# Altium schematic sheet CanGateLPC1768_rev1.SchDoc
size A3
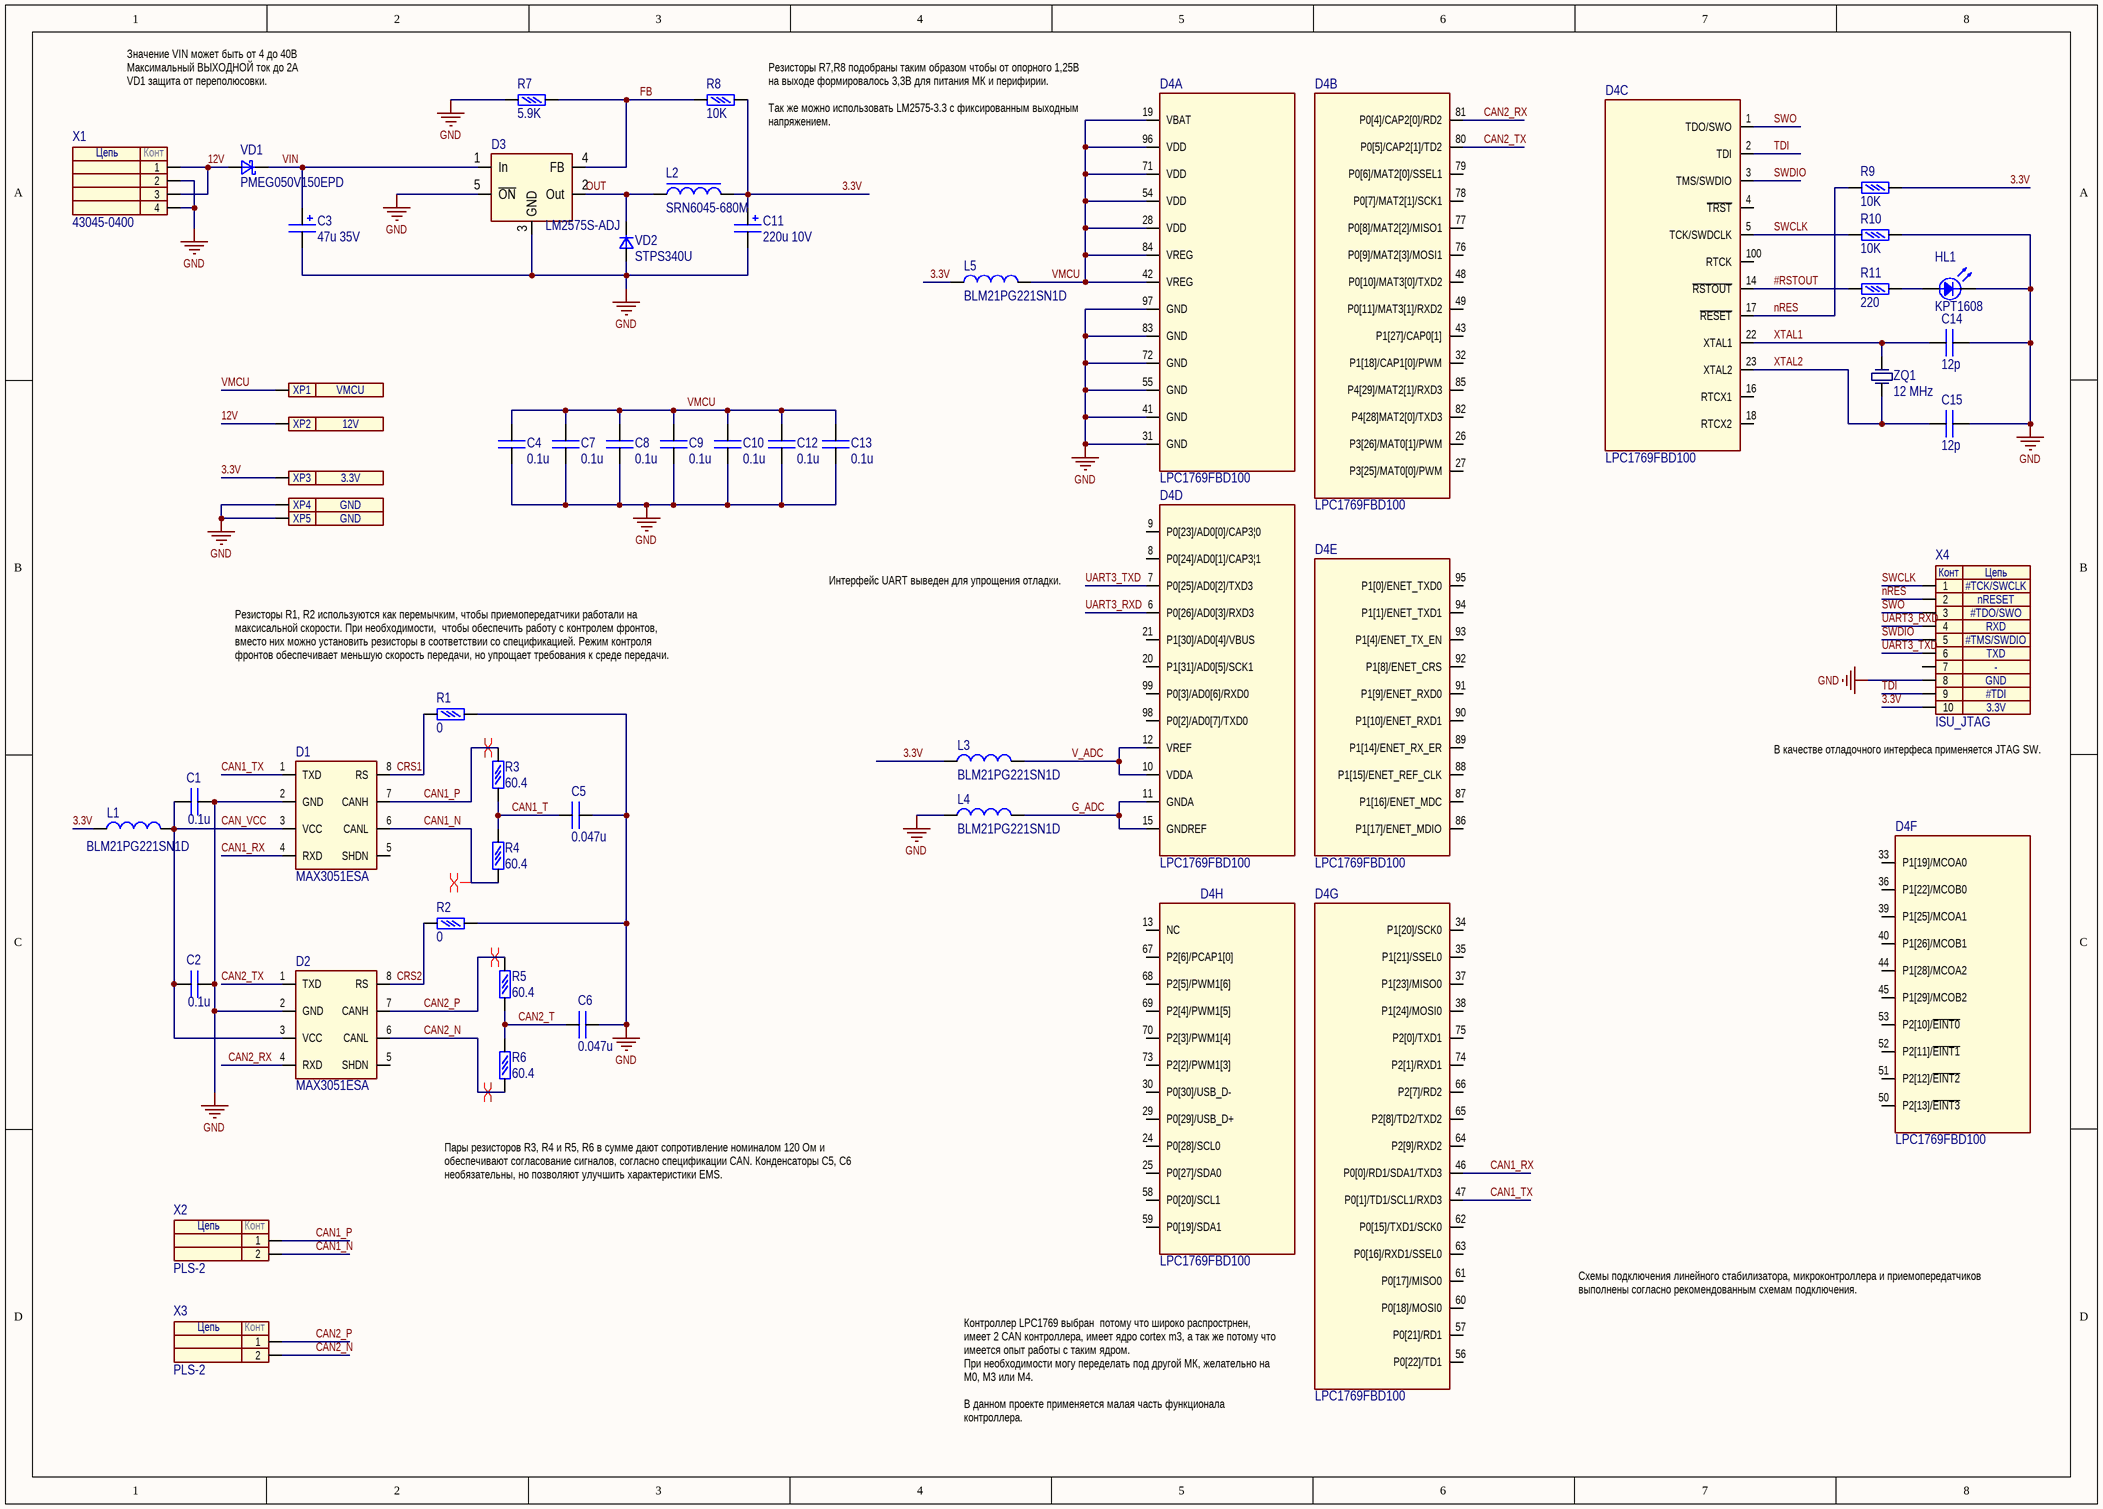
[diagram p0: CanGateLPC1768_rev1.SchDoc]

## Parts
C1  0.1u  [C 0603]
C2  0.1u  [C 0603]
C3  47u 35V  [C E-CASE]
C4  0.1u  [C 0603]
C5  0.047u  [C 0603]
C6  0.047u  [C 0603]
C7  0.1u  [C 0603]
C8  0.1u  [C 0603]
C9  0.1u  [C 0603]
C10  0.1u  [C 0603]
C11  220u 10V  [C D-CASE]
C12  0.1u  [C 0603]
C13  0.1u  [C 0603]
C14  12p  [C 0603]
C15  12p  [C 0603]
D1  MAX3051ESA  [SO-8]
D2  MAX3051ESA  [SO-8]
D3  LM2575S-ADJ  [DPAK-5]
D4  LPC1769FBD100  [LQFP100]  (parts A,B,C,D,E,F,G,H of 8)
HL1  KPT1608  [HL 1608]
L1  BLM21PG221SN1D  [L 0805]
L2  SRN6045-680M  [L SRN6045]
L3  BLM21PG221SN1D  [L 0805]
L4  BLM21PG221SN1D  [L 0805]
L5  BLM21PG221SN1D  [L 0805]
R1  0  [R 0603]
R2  0  [R 0603]
R3  60.4  [R 0603]
R4  60.4  [R 0603]
R5  60.4  [R 0603]
R6  60.4  [R 0603]
R7  5.9K  [R 0603]
R8  10K  [R 0603]
R9  10K  [R 0603]
R10  10K  [R 0603]
R11  220  [R 0603]
VD1  PMEG050V150EPD  [VD SOT1289]
VD2  STPS340U  [VD SMB]
X1  43045-0400  [MICRO-FIT-4]
X2  PLS-2  [JST XH B2B-XH-A]
X3  PLS-2  [JST XH B2B-XH-A]
X4  ISU_JTAG  [PLD2-10]
XP1  VMCU  [Test Pin]  (no BOM)
XP2  12V  [Test Pin]  (no BOM)
XP3  3.3V  [Test Pin]  (no BOM)
XP4  GND  [Test Pin]  (no BOM)
XP5  GND  [Test Pin]  (no BOM)
ZQ1  12 MHz  [ZQ HC-49SMD]

## Nets
GND: C1.2 C2.2 C3.2 C4.2 C5.2 C6.2 C7.2 C8.2 C9.2 C10.2 C11.2 C12.2 C13.2 C14.1 C15.2 D1.2(GND) D2.2(GND) D3.3(GND) D3.5(~{ON}) D4.31(GND) D4.41(GND) D4.55(GND) D4.72(GND) D4.83(GND) D4.97(GND) HL1.2 L4.1 R1.1 R2.1 R7.1 R10.1 VD2.1 X1.2 X1.4 X4.8 XP4.1 XP5.1
3.3V: C11.1 L1.1 L2.2 L3.1 L5.1 R8.2 R9.1 X4.10 XP3.1
12V: VD1.1 X1.1 X1.3 XP2.1
#RSTOUT: D4.14(~{RSTOUT}) R11.2
CAN1_N: D1.6(CANL) R4.2 X2.2
CAN1_P: D1.7(CANH) R3.1 X2.1
CAN1_RX: D1.4(RXD) D4.46(P0[0]/RD1/SDA1/TXD3)
CAN1_T: C5.1 R3.2 R4.1
CAN1_TX: D1.1(TXD) D4.47(P0[1]/TD1/SCL1/RXD3)
CAN2_N: D2.6(CANL) R6.2 X3.2
CAN2_P: D2.7(CANH) R5.1 X3.1
CAN2_RX: D2.4(RXD) D4.81(P0[4]/CAP2[0]/RD2)
CAN2_T: C6.1 R5.2 R6.1
CAN2_TX: D2.1(TXD) D4.80(P0[5]/CAP2[1]/TD2)
CAN_VCC: C1.1 C2.1 D1.3(VCC) D2.3(VCC) L1.2
CRS1: D1.8(RS) R1.2
CRS2: D2.8(RS) R2.2
FB: D3.4(FB) R7.2 R8.1
G_ADC: D4.11(GNDA) D4.15(GNDREF) L4.2
nRES: D4.17(~{RESET}) R9.2 X4.2
OUT: D3.2(Out) L2.1 VD2.2
SWCLK: D4.5(TCK/SWDCLK) R10.2 X4.1
SWDIO: D4.3(TMS/SWDIO) X4.5
SWO: D4.1(TDO/SWO) X4.3
TDI: D4.2(TDI) X4.9
UART3_RXD: D4.6(P0[26]/AD0[3]/RXD3) X4.4
UART3_TXD: D4.7(P0[25]/AD0[2]/TXD3) X4.6
V_ADC: D4.10(VDDA) D4.12(VREF) L3.2
VIN: C3.1 D3.1(In) VD1.2
VMCU: C4.1 C7.1 C8.1 C9.1 C10.1 C12.1 C13.1 D4.19(VBAT) D4.28(VDD) D4.42(VREG) D4.54(VDD) D4.71(VDD) D4.84(VREG) D4.96(VDD) L5.2 XP1.1
XTAL1: C14.2 D4.22(XTAL1) ZQ1.2
XTAL2: C15.1 D4.23(XTAL2) ZQ1.1
NetHL1_1: HL1.1 R11.1

Not connected (* = marked no-connect by the designer): D1 5(SHDN); D2 5(SHDN); D4 4(~{TRST}) 8(P0[24]/AD0[1]/CAP3|1) 9(P0[23]/AD0[0]/CAP3|0) 13(NC) 16(RTCX1) 18(RTCX2) 20(P1[31]/AD0[5]/SCK1) 21(P1[30]/AD0[4]/VBUS) 24(P0[28]/SCL0) 25(P0[27]/SDA0) 26(P3[26]/MAT0[1]/PWM) 27(P3[25]/MAT0[0]/PWM) 29(P0[29]/USB_D+) 30(P0[30]/USB_D-) 32(P1[18]/CAP1[0]/PWM) 33(P1[19]/MCOA0) 34(P1[20]/SCK0) 35(P1[21]/SSEL0) 36(P1[22]/MCOB0) 37(P1[23]/MISO0) 38(P1[24]/MOSI0) 39(P1[25]/MCOA1) 40(P1[26]/MCOB1) 43(P1[27]/CAP0[1]) 44(P1[28]/MCOA2) 45(P1[29]/MCOB2) 48(P0[10]/MAT3[0]/TXD2) 49(P0[11]/MAT3[1]/RXD2) 50(P2[13]/~{EINT3}) 51(P2[12]/~{EINT2}) 52(P2[11]/~{EINT1}) 53(P2[10]/~{EINT0}) 56(P0[22]/TD1) 57(P0[21]/RD1) 58(P0[20]/SCL1) 59(P0[19]/SDA1) 60(P0[18]/MOSI0) 61(P0[17]/MISO0) 62(P0[15]/TXD1/SCK0) 63(P0[16]/RXD1/SSEL0) 64(P2[9]/RXD2) 65(P2[8]/TD2/TXD2) 66(P2[7]/RD2) 67(P2[6]/PCAP1[0]) 68(P2[5]/PWM1[6]) 69(P2[4]/PWM1[5]) 70(P2[3]/PWM1[4]) 73(P2[2]/PWM1[3]) 74(P2[1]/RXD1) 75(P2[0]/TXD1) 76(P0[9]/MAT2[3]/MOSI1) 77(P0[8]/MAT2[2]/MISO1) 78(P0[7]/MAT2[1]/SCK1) 79(P0[6]/MAT2[0]/SSEL1) 82(P4[28]MAT2[0]/TXD3) 85(P4[29]/MAT2[1]/RXD3) 86(P1[17]/ENET_MDIO) 87(P1[16]/ENET_MDC) 88(P1[15]/ENET_REF_CLK) 89(P1[14]/ENET_RX_ER) 90(P1[10]/ENET_RXD1) 91(P1[9]/ENET_RXD0) 92(P1[8]/ENET_CRS) 93(P1[4]/ENET_TX_EN) 94(P1[1]/ENET_TXD1) 95(P1[0]/ENET_TXD0) 98(P0[2]/AD0[7]/TXD0) 99(P0[3]/AD0[6]/RXD0) 100(RTCK); X4 7

## Layout directives
differential pair: CAN1_N, CAN1_P, CAN2_N, CAN2_P

## Notes on the sheet
- (near R7) Значение VIN может быть от 4 до 40В
  Максимальный ВЫХОДНОЙ ток до 2А
  VD1 защита от переполюсовки.
- (near R8) Резисторы R7,R8 подобраны таким образом чтобы от опорного 1,25В на выходе формировалось 3,3В для питания МК и перифирии.
  Так же можно использовать LM2575-3.3 c фиксированным выходным напряжением.
- Интерфейс UART выведен для упрощения отладки.
- (near R1) Резисторы R1, R2 используются как перемычким, чтобы приемопередатчики работали на максисальной скорости. При необходимости,  чтобы обеспечить работу с контролем фронтов, вместо них можно установить резисторы в соответствии со спецификацией. Режим контроля фронтов обеспечивает меньшую скорость передачи, но упрощает требования к среде передачи.
- В качестве отладочного интерфеса применяется JTAG SW.
- Пары резисторов R3, R4 и R5, R6 в сумме дают сопротивление номиналом 120 Ом и обеспечивают согласование сигналов, согласно спецификации CAN. Конденсаторы C5, C6 необязательны, но позволяют улучшить характеристики EMS.
- Схемы подключения линейного стабилизатора, микроконтроллера и приемопередатчиков выполнены согласно рекомендованным схемам подключения.
- Контроллер LPC1769 выбран  потому что широко распрострнен,  имеет 2 CAN контроллера, имеет ядро cortex m3, а так же потому что имеется опыт работы с таким ядром.
  При необходимости могу переделать под другой МК, желательно на М0, М3 или М4.
  В данном проекте применяется малая часть функционала контроллера.
- (in symbol ISU_JTAG) Конт; Цепь; #TCK/SWCLK; nRESET; #TDO/SWO; RXD; #TMS/SWDIO; TXD; -; GND; #TDI; 3.3V
- (in symbol MICRO-FIT-4) Цепь; Конт
- (in symbol PLS-2) Цепь; Конт

## Library data of the parts
C1 C2 C4 C7-C10 C12 C13 = C 0603: Чип конденсатор керамический; R1: 0603; R2: 50V; Remark: C.801; ComponentLink1Description: Datasheet; ComponentLink1URL: http://www.smd.ru/katalog/kondensatory/keramicheskie/
C3 = C E-CASE: Чип конденсатор танталовый; R1: 'E'; ComponentLink1Description: Datasheet; ComponentLink1URL: http://www.smd.ru/katalog/kondensatory/polyarnye/tantalovye/
C5 C6 = C 0603: Чип конденсатор керамический; R1: 0603; R2: 50V; Remark: C.806; ComponentLink1Description: Datasheet; ComponentLink1URL: http://www.smd.ru/katalog/kondensatory/keramicheskie/
C11 = C D-CASE: Чип конденсатор танталовый; R1: 'D'; ComponentLink1Description: Datasheet; ComponentLink1URL: http://www.smd.ru/katalog/kondensatory/polyarnye/tantalovye/
C14 C15 = C 0603: Чип конденсатор керамический; R1: 0603; R2: 50V; Remark: C.608; ComponentLink1Description: Datasheet; ComponentLink1URL: http://www.smd.ru/katalog/kondensatory/keramicheskie/
D1 D2 = CAN MAX3051: CAN трансивер; Remark: D.30; ComponentLink1URL: http://www.farnell.com/datasheets/663306.pdf; ComponentLink1Description: Datasheet
D3 = DCDC LM2576S: DC/DC преобразователь; ComponentLink1URL: http://www.ti.com/lit/ds/symlink/lm2576.pdf; ComponentLink1Description: Datasheet
D4 = LPC1769FBD100: Микроконтроллер; Analog: Аналог: LPC1768FBD100; Remark: D.9; ComponentLink1Description: Datasheet; ComponentLink1URL: http://www.nxp.com/documents/user_manual/UM10360.pdf?fasp=1&WT_TYPE=Users%20Guides&WT_VENDOR=FREESCALE&WT_FILE_FORMAT=pdf&WT_ASSET=Documentation&fileExt=.pdf
HL1 = HL KPT1608: Чип светодиод; Remark: HL.1; ComponentLink1Description: Datasheet; ComponentLink1URL: http://datasheet.seekic.com/PdfFile/KPT/KPT1608_KPT1608EC_KPT1608HC_KPT1608H.pdf
L1 L3-L5 = L 0805: Чип индуктивность; R1: 0805; ComponentLink1Description: Datasheet
L2 = L SRN6045: Индуктивность; ComponentLink1Description: Datasheet; ComponentLink1URL: http://www.bourns.com/data/global/pdfs/SRN6045.pdf
R1 R2 R9 R10 = R 0603: Чип резистор; Remark: R.803; R1: 0603; R2: ±1%; ComponentLink1Description: Datasheet; ComponentLink1URL: http://www.smd.ru/katalog/rezistory_i_potenciometry/
R3-R6 = R 0603: Чип резистор; Remark: R.716; R1: 0603; R2: ±1%; ComponentLink1Description: Datasheet; ComponentLink1URL: http://www.smd.ru/katalog/rezistory_i_potenciometry/
R7 R8 = R 0603: Чип резистор; R1: 0603; R2: ±1%; ComponentLink1Description: Datasheet; ComponentLink1URL: http://www.smd.ru/katalog/rezistory_i_potenciometry/
R11 = R 0603: Чип резистор; Remark: R.713; R1: 0603; R2: ±1%; ComponentLink1Description: Datasheet; ComponentLink1URL: http://www.smd.ru/katalog/rezistory_i_potenciometry/
VD1 = VD SOT1289: Диод Шоттки; Remark: VD.6; R1: SOT1289; ComponentLink1Description: Datasheet; ComponentLink1URL: http://www.farnell.com/datasheets/1965377.pdf
VD2 = VD SMB: Диод Шоттки; R1: SMB; ComponentLink1Description: Datasheet; ComponentLink1URL: http://www.st.com/content/ccc/resource/technical/document/datasheet/bb/db/21/0c/04/d9/41/a5/CD00000844.pdf/files/CD00000844.pdf/jcr:content/translations/en.CD00000844.pdf
X1 = MICRO-FIT-4: Разъем MicroFit; R1: 3.0; Remark: X.64; ComponentLink1URL: http://www.mt-system.ru/sites/default/files/docs/documents/43045-0x00_sd.pdf; ComponentLink1Description: Description
X2 X3 = PLS-2: Вилка штыревая; R1: 2.54; ComponentLink1URL: http://www.platan.ru/pdf/ec278.pdf; ComponentLink1Description: Datasheet
X4 = ISU_JTAG: Вилка штыревая; Remark: X.37; R1: 2.0; ComponentLink1URL: http://www.platan.ru/pdf/ec278.pdf; ComponentLink1Description: Description
XP1-XP5 = Test Pin: Тестовый контакт
ZQ1 = ZQ HC-49SMD: Кварцевый резонатор; R1: 0532 MJ; ComponentLink1Description: Datasheet; ComponentLink1URL: http://www.platan.ru/pdf/datasheets/quartz/HC-49SMD.pdf